# Altium project Car_Follower_Main.PrjPcb
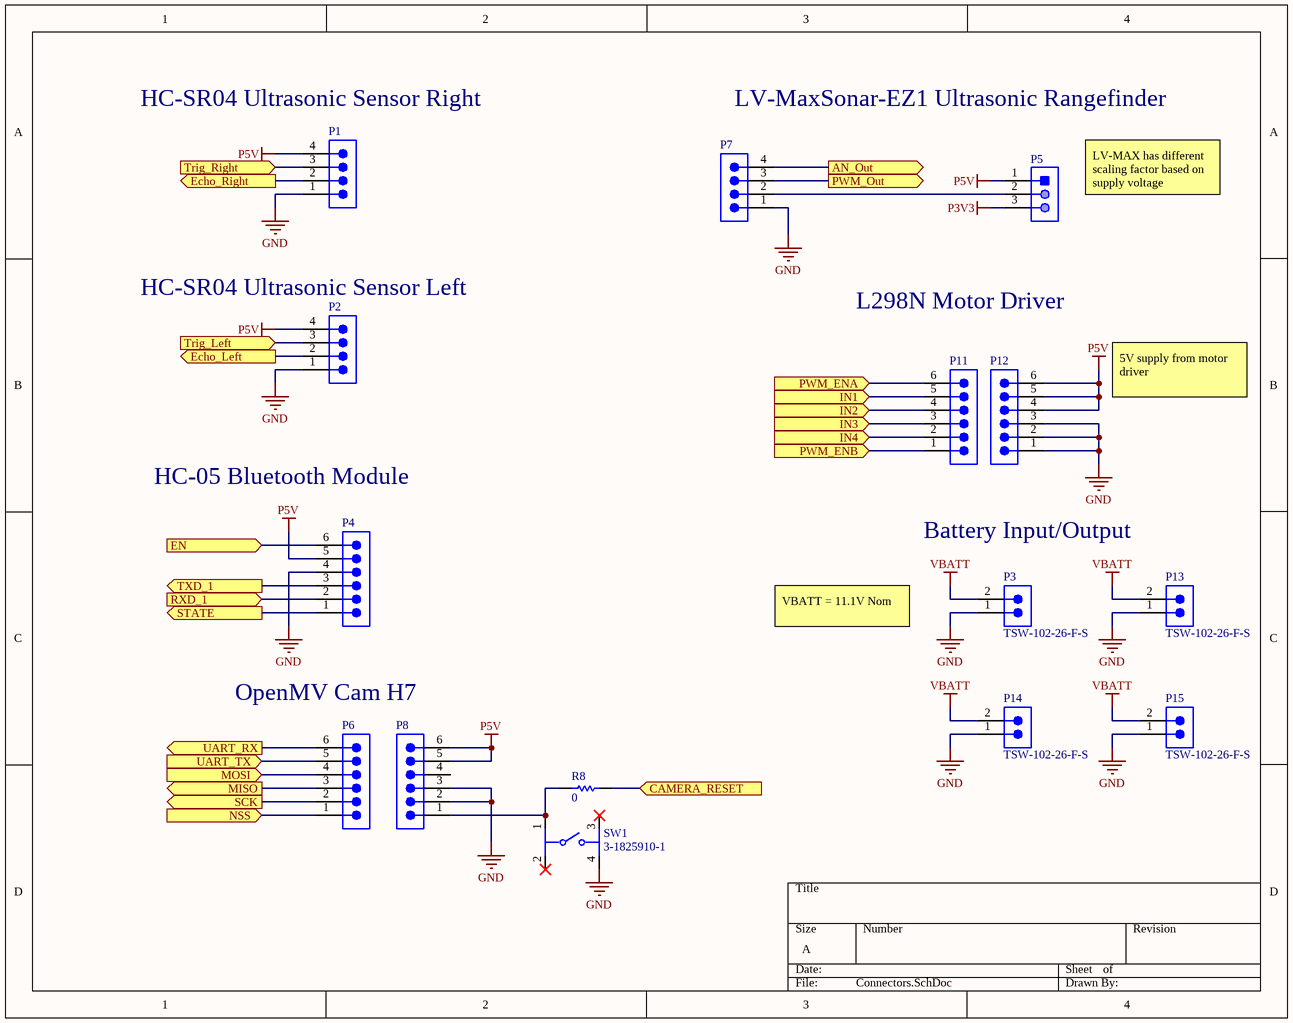
[diagram p0: Connectors.SchDoc]
2 sheets, 35 parts. Net scope: flat (ports and power ports of the same name join across sheets).
Board file: Auto_Follower_Controller.PcbDoc
Sheets:
  Connectors.SchDoc
  Power_Tree.SchDoc

## Sheet Connectors.SchDoc
size A; SheetNumber: 1; SheetTotal: 5

### Parts
P1  TSW-104-08-T-S  [SMTC-TSW-104-08-X-S]  (value not drawn)
P2  TSW-104-08-T-S  [SMTC-TSW-104-08-X-S]  (value not drawn)
P3  TSW-102-26-F-S  [SMTC-TSW-102-26-XX-S]
P4  TSW-106-23-G-S  [SMTC-TSW-106-23-X-S]  (value not drawn)
P5  87224-3  [TECO-87224-3_V]  (value not drawn)
P6  TSW-106-23-G-S  [SMTC-TSW-106-23-X-S]  (value not drawn)
P7  TSW-104-08-T-S  [SMTC-TSW-104-08-X-S]  (value not drawn)
P8  TSW-106-23-G-S  [SMTC-TSW-106-23-X-S]  (value not drawn)
P11  TSW-106-23-G-S  [SMTC-TSW-106-23-X-S]  (value not drawn)
P12  TSW-106-23-G-S  [SMTC-TSW-106-23-X-S]  (value not drawn)
P13  TSW-102-26-F-S  [SMTC-TSW-102-26-XX-S]
P14  TSW-102-26-F-S  [SMTC-TSW-102-26-XX-S]
P15  TSW-102-26-F-S  [SMTC-TSW-102-26-XX-S]
R8  value 0  [RESC3216X60X45ML15T20]  (hidden comment: Resistor 0R +/- 5% 1206 250 mW)
SW1  3-1825910-1  [FP-3-1825910-1-MFG]

### Ports
AN_Out (out), CAMERA_RESET (in), Echo_Left (out), Echo_Right (out), EN (in), IN1 (in), IN2 (in), IN3 (in), IN4 (in), MISO (out), MOSI (in), NSS (in), PWM_ENA (in), PWM_ENB (in), PWM_Out (out), RXD_1 (in), SCK (out), STATE (out), Trig_Left (in), Trig_Right (in), TXD_1 (out), UART_RX (out), UART_TX (in)

### Nets
GND: P1.1 P2.1 P3.1 P4.4 P7.1 P8.2 P8.3 P12.1 P12.2 P12.3 P13.1 P14.1 P15.1 SW1.4
P3V3: P5.3
P5V: P1.4 P2.4 P4.5 P5.1 P8.5 P8.6 P12.4 P12.5 P12.6
VBATT: P3.2 P13.2 P14.2 P15.2
NetP1_2: P1.2 ; port Echo_Right
NetP1_3: P1.3 ; port Trig_Right
NetP2_2: P2.2 ; port Echo_Left
NetP2_3: P2.3 ; port Trig_Left
NetP4_1: P4.1 ; port STATE
NetP4_2: P4.2 ; port RXD_1
NetP4_3: P4.3 ; port TXD_1
NetP4_6: P4.6 ; port EN
NetP5_2: P5.2 P7.2
NetP6_1: P6.1 ; port NSS
NetP6_2: P6.2 ; port SCK
NetP6_3: P6.3 ; port MISO
NetP6_4: P6.4 ; port MOSI
NetP6_5: P6.5 ; port UART_TX
NetP6_6: P6.6 ; port UART_RX
NetP7_3: P7.3 ; port PWM_Out
NetP7_4: P7.4 ; port AN_Out
NetP8_1: P8.1 R8.1 SW1.1
NetP11_1: P11.1 ; port PWM_ENB
NetP11_2: P11.2 ; port IN4
NetP11_3: P11.3 ; port IN3
NetP11_4: P11.4 ; port IN2
NetP11_5: P11.5 ; port IN1
NetP11_6: P11.6 ; port PWM_ENA
NetR8_2: R8.2 ; port CAMERA_RESET

Not connected (* = marked no-connect by the designer): P8 4; SW1 2* 3*

### Notes on the sheet
- (near P1) HC-SR04 Ultrasonic Sensor Right
- LV-MaxSonar-EZ1 Ultrasonic Rangefinder
- LV-MAX has different scaling factor based on supply voltage
- (near P2) HC-SR04 Ultrasonic Sensor Left
- L298N Motor Driver
- 5V supply from motor driver
- HC-05 Bluetooth Module
- Battery Input/Output
- VBATT = 11.1V Nom
- OpenMV Cam H7

### Library data of the parts
P1 P2 P7 = CMP-1024-00356-1: 0.025" SQ Post Header, Through-hole, Vertical, -55 to 105 degC, 2.54 mm Pitch, 4-Pin, Male, RoHS; Manufacturer: Samtec; Pitch: 2.54 mm; PackageDescription: .025[0.64] SQ. Post Terminal Strip Assembly; ComponentLink2URL: http://www.samtec.com/documents/webfiles/pdf/TSW_TH.PDF; ComponentLink3URL: http://www.samtec.com/documents/webfiles/cpdf/TSW-XXX-XX-XXX-X-XX-XXX-MKT.pdf; PackageVersion: DM, 8/1988; ComponentLink3Description: Package Specification; DatasheetVersion: F-214; Orientation: Vertical; RoHS: True; Mounting Technology: Through-hole; ComponentLink1URL: http://www.samtec.com; PartNumber: TSW-104-08-T-S; ComponentLink1Description: Manufacturer URL; Temperature Range: -55 to 105 degC; ComponentLink2Description: Datasheet; PackageReference: TSW-104-08-X-S
P3 P13-P15 = CMP-002-00072-1: Headers & Wire Housings Classic PCB Header Strips, 0.100 pitch; Number of Positions: 2; Max Voltage Rating (AC): 550V; Gender: Male; Pitch: 2.54mm; Contact Post Length: 3.2mm; Voltage Rating: 500V; Max Current Rating: 7.6A; Contact Material: Bronze; Contact Gender: Male; Contact Type: -; REACH SVHC: No SVHC; Min Operating Temperature: -55°C; Housing Material: Polyester; Packaging: Bulk; Termination: Through Hole; Max Operating Temperature: 125°C; Orientation: Vertical; Flammability Rating: UL94 V-0; Package Quantity: 1; Depth: 2.54mm; Contact Plating: Gold; Number of Rows: 1; Radiation Hardening: No; Number of Contacts: 2; Length: 5.08mm; RoHS Compliant: Yes; Housing Color: Black; Weight: 0.001257oz; Contact Mating Length: 5.84mm; Series: TSW
P4 P6 P8 P11 P12 = CMP-1024-00396-1: 0.025" SQ Post Header, Through-hole, Vertical, -55 to 125 degC, 2.54 mm Pitch, 6-Pin, Male, RoHS; Manufacturer: Samtec; Pitch: 2.54 mm; Orientation: Vertical; Mounting Technology: Through-hole; RoHS: True; PackageVersion: DM, 8/1988; ComponentLink3Description: Package Specification; PackageDescription: .025[0.64] SQ. Post Terminal Strip Assembly; ComponentLink2URL: http://www.samtec.com/documents/webfiles/pdf/TSW_TH.PDF; PartNumber: TSW-106-23-G-S; Temperature Range: -55 to 125 degC; PackageReference: TSW-106-23-X-S; ComponentLink1Description: Manufacturer URL; ComponentLink2Description: Datasheet; ComponentLink3URL: http://www.samtec.com/documents/webfiles/cpdf/TSW-XXX-XX-XXX-X-XX-XXX-MKT.pdf; DatasheetVersion: F-214; ComponentLink1URL: http://www.samtec.com
P5 = CMP-2000-05697-1: Male Header, Pitch 2.54 mm, 1 x 3 Position, Height 10.744 mm, Tail Length 3.175 mm, -65 to 105 degC, RoHS, Bulk; Manufacturer: TE Connectivity; Catalog Drawings: SingleSquareStraightPost / SingleSquareStraightPostSide; Connector Type: Header,Unshrouded; Pitch: 0.100"(2.54mm); Mating Products: 147738-2-ND / -CONNRCPT3POSVERTSMDGOLD / 147723-2-ND / -CONNRCPT3POSVERT.100GOLD / 146763-5-ND / -CONNRCPT3POSSGLVERT.100T/H / A32904-ND / -CONNRECEPT3POS.100VERTGOLD / A26922-ND / -CONNHOUSING3POS.100LOCKING / A26415-ND / -CONNRECEPT3POS.100VERTAU / A26964-ND / -CONNHOUSING3POS.100SINGLE / A3012-ND / -CONNHOUSING3POS.100SINGLE; Number of Positions Loaded: All; Featured Product: AMPMODUConnectors; Dynamic Catalog: AMPMODUModIISeries; 3D Model: 87224-3.pdf; Other Names: 87224-3-ND / A26545; Number of Positions: 3; RoHS Information: 87224-3StatementofCompliance; Termination: Solder; Datasheet URL: http://www.te.com/commerce/DocumentDelivery/DDEController?Action=showdoc&DocId=Customer+Drawing%7F87224%7FL3%7Fpdf%7FEnglish%7FENG_CD_87224_L3.pdf%7F87224-3; Category: Connectors,Interconnects; Contact Mating Length: 0.318"(8.08mm); Standard Package: 520; Mounting Type: ThroughHole; Family: RectangularConnectors-Headers,MalePins; Number of Rows: 1; Series: AMPMODUModII; Contact Finish Thickness: 15µin(0.38µm); Datasheet Version: Rev. L3, 08/2015; Package Reference: 87224-3; Mounting Technology: ThroughHole; Manufacturer URL: http://www.te.com/; Contact Type: MalePin; Packaging: Bulk; Color: Black; Package Description: Male Header, Pitch 2.54 mm, 1 x 3 Position, Height 10.744 mm, Tail Length 3.175 mm; Contact Finish: Gold
R8 = CMP-009-00002-4: Chip Resistor, 0 Ohm, +/- 5%, 0.25 W, -55 to 155 degC, 1206 (3216 Metric); Voltage Rating: 200V; Power: 250mW; Case/Package: 1206; Mounting Technology: SM; RoHS Compliant: True; Min Operating Temperature: -55°C; Max Operating Temperature: 155°C; Tolerance: 5%; Pins: 2
SW1 = CMP-03407-000001-1: SWITCH TACTILE SPST-NO 0.05A 24V; Manufacturer: TE Connectivity; Operating Force: 160gf; Contact Current Rating: 50mA; Description: Switch Tactile OFF (ON) SPST Round Button PC Pins 0.05A 24VDC 100000Cycles 1.57N Thru-Hole; Contact Resistance: 100mΩ; Electromechanical Life: 100000Cycles; Device Class L1: Electromechanical; ComponentLink2URL: https://www.te.com/commerce/DocumentDelivery/DDEController?Action=srchrtrv&DocNm=1825910&DocType=Customer+Drawing&DocLang=English; Category: Switch; Device Class L2: Switches; Temperature: -35°C to +85°C; RoHS: TRUE; Mount: Through Hole; Manufacturer Part Number: 3-1825910-1; Automotive: No; Lead Free: Yes; Device Class L3: Tactile Switches; ComponentLink2Description: Datasheet; Temperature Range High: +85°C; Height: 17.3mm; Package: 0; Temperature Range Low: -35°C; Throw Configuration: SPST-NO; Digikey Description: SWITCH TACTILE SPST-NO 0.05A 24V; Octopart: https://octopart.com/3-1825910-1-te+connectivity-46506874

## Sheet Power_Tree.SchDoc
size A; SheetNumber: 3; SheetTotal: 5
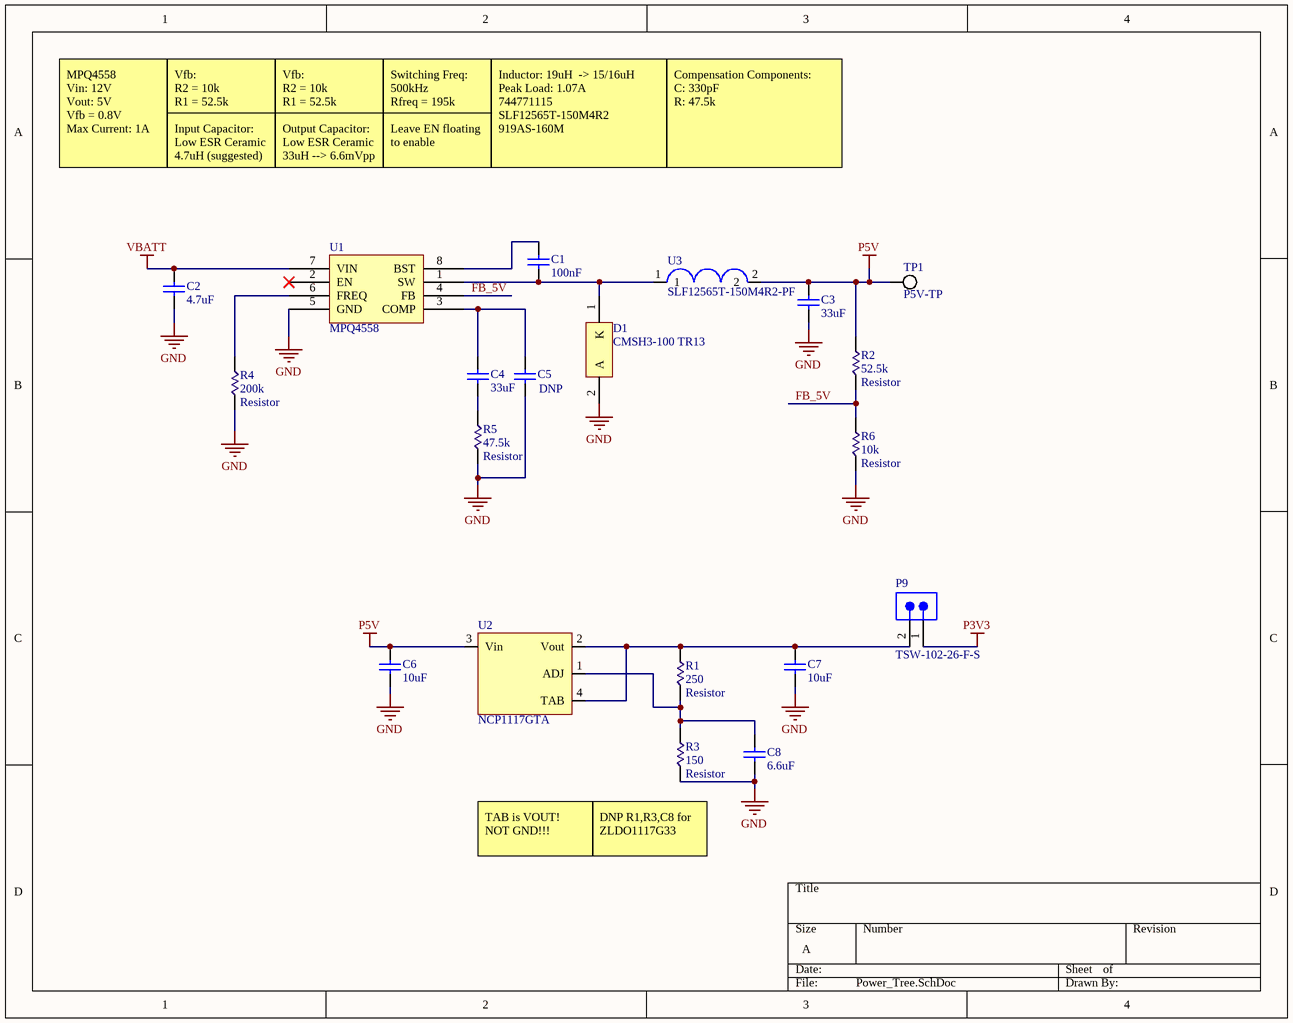
[diagram p1: Power_Tree.SchDoc]

### Parts
C1  value 100nF  [FOOTPRINT-1206-GEN]  (hidden comment: 100nF 1206)
C2  value 4.7uF  [FOOTPRINT-1206-GEN]  (hidden comment: CL31B475KBHVPNE)
C3  value 33uF  [FOOTPRINT-1206-GEN]
C4  value 33uF  [FOOTPRINT-1206-GEN]
C5  DNP  [FOOTPRINT-1206-GEN]
C6  value 10uF  [FOOTPRINT-1206-GEN]
C7  value 10uF  [FOOTPRINT-1206-GEN]
C8  value 6.6uF  [FOOTPRINT-1206-GEN]
D1  CMSH3-100 TR13  [ONSC-SMB-2-403A-03_V]
P9  TSW-102-26-F-S  [SMTC-TSW-102-26-XX-S]
R1  value 250  Type: Resistor  [FOOTPRINT-1206-GEN]  (hidden comment: Resistor 250 +/-1% 1206 1/4W)
R2  value 52.5k  Type: Resistor  [FOOTPRINT-1206-GEN]  (hidden comment: Resistor 52.5k +/-1% 1206 1/4W)
R3  value 150  Type: Resistor  [FOOTPRINT-1206-GEN]  (hidden comment: Resistor 150 +/-1% 1206 1/4W)
R4  value 200k  Type: Resistor  [FOOTPRINT-1206-GEN]  (hidden comment: Resistor 200k +/-1% 1206 1/4W)
R5  value 47.5k  Type: Resistor  [FOOTPRINT-1206-GEN]  (hidden comment: Resistor 47.5k +/-1% 1206 1/4W)
R6  value 10k  Type: Resistor  [FOOTPRINT-1206-GEN]  (hidden comment: Resistor 10k +/-1% 1206 1/4W)
TP1  P5V-TP  [FOOTPRINT-GENERIC-TP-VIA-1MM]  (no BOM)
U1  MPQ4558  [SOIC127P601X173-9N]
U2  NCP1117GTA  [SOT230P700X180-4N]
U3  SLF12565T-150M4R2-PF  [0.492" x 0.492"]

### Nets
GND: C2.1 C3.1 C5.1 C6.1 C7.1 C8.1 D1.2(A) R3.1 R4.1 R5.1 R6.1 U1.5(GND)
P3V3: P9.1
P5V: C3.2 C6.2 R2.2 TP1.1(TP) U2.3(Vin) U3.2
VBATT: C2.2 U1.7(VIN)
FB_5V: R2.1 R6.2 U1.4(FB)
NetC1_1: C1.1 D1.1(K) U1.1(SW) U3.1
NetC1_2: C1.2 U1.8(BST)
NetC4_1: C4.1 R5.2
NetC4_2: C4.2 C5.2 U1.3(COMP)
NetC7_2: C7.2 P9.2 R1.2 U2.2(Vout) U2.4(TAB)
NetC8_2: C8.2 R1.1 R3.2 U2.1(ADJ)
NetR4_2: R4.2 U1.6(FREQ)

Not connected (* = marked no-connect by the designer): U1 2(EN)*

### Notes on the sheet
- MPQ4558
  Vin: 12V
  Vout: 5V
  Vfb = 0.8V
  Max Current: 1A
- Vfb:
  R2 = 10k
  R1 = 52.5k
- Input Capacitor:
  Low ESR Ceramic
  4.7uH (suggested)
- Output Capacitor:
  Low ESR Ceramic
  33uH --> 6.6mVpp
- Switching Freq: 500kHz
  Rfreq = 195k
- Leave EN floating to enable
- Inductor: 19uH  -> 15/16uH
  Peak Load: 1.07A
  744771115
  SLF12565T-150M4R2
  919AS-160M
- Compensation Components:
  C: 330pF
  R: 47.5k
- TAB is VOUT!
  NOT GND!!!
- (near R3) DNP R1,R3,C8 for
  ZLDO1117G33

### Library data of the parts
C1 = CMP-001-00085-2: CAP CER 100nF 50V X7R 1206 ±10% 50V Ceramic Capacitor X7R 1206 (3216 Metric); Part Number: 1276-6781-1-ND; Published: 8-Jun-2000; LatestRevisionNote: Re-released for DXP Platform.; PackageReference: RAD-0.3; Publisher: Altium Limited; PackageDescription: Radial Cap, Thru-Hole; 2 Leads; 0.3 in Pin Spacing; Design Item ID: Capacitor-Generic-1206; Source: Generic.SchLib; Type: Capacitor
C2 = CMP-001-00085-2: CAP CER 4.7UF 50V X7R 1206 ±10% 50V Ceramic Capacitor X7R 1206 (3216 Metric); Part Number: 1276-6781-1-ND; Published: 8-Jun-2000; LatestRevisionNote: Re-released for DXP Platform.; PackageReference: RAD-0.3; Publisher: Altium Limited; PackageDescription: Radial Cap, Thru-Hole; 2 Leads; 0.3 in Pin Spacing; Design Item ID: Capacitor-Generic-1206; Source: Generic.SchLib; Type: Capacitor
C3 C4 = CMP-001-00085-2: CAP CER 33UF 50V X7R 1206 ±10% 50V Ceramic Capacitor X7R 1206 (3216 Metric); Part Number: 1276-6781-1-ND; Published: 8-Jun-2000; LatestRevisionNote: Re-released for DXP Platform.; PackageReference: RAD-0.3; Publisher: Altium Limited; PackageDescription: Radial Cap, Thru-Hole; 2 Leads; 0.3 in Pin Spacing; Design Item ID: Capacitor-Generic-1206; Source: Generic.SchLib; Type: Capacitor
C5 = CMP-001-00085-2: 1206; Part Number: 1276-6781-1-ND; Type: Capacitor; Published: 8-Jun-2000; LatestRevisionNote: Re-released for DXP Platform.; PackageReference: RAD-0.3; Publisher: Altium Limited; PackageDescription: Radial Cap, Thru-Hole; 2 Leads; 0.3 in Pin Spacing; Design Item ID: Capacitor-Generic-1206; Source: Generic.SchLib
C6 C7 = CMP-001-00085-2: CAP CER 10UF 50V X7R 1206 ±10% 50V Ceramic Capacitor X7R 1206 (3216 Metric); Part Number: 1276-6781-1-ND; Published: 8-Jun-2000; LatestRevisionNote: Re-released for DXP Platform.; PackageReference: RAD-0.3; Publisher: Altium Limited; PackageDescription: Radial Cap, Thru-Hole; 2 Leads; 0.3 in Pin Spacing; Design Item ID: Capacitor-Generic-1206; Source: Generic.SchLib; Type: Capacitor
C8 = CMP-001-00085-2: CAP CER 6.6UF 50V X7R 1206 ±10% 50V Ceramic Capacitor X7R 1206 (3216 Metric); Part Number: 1276-6781-1-ND; Published: 8-Jun-2000; LatestRevisionNote: Re-released for DXP Platform.; PackageReference: RAD-0.3; Publisher: Altium Limited; PackageDescription: Radial Cap, Thru-Hole; 2 Leads; 0.3 in Pin Spacing; Design Item ID: Capacitor-Generic-1206; Source: Generic.SchLib; Type: Capacitor
D1 = CMP-1055-00373-1: CMSH3-100 TR13 Schottky Power Rectifier, 2-Pin SMB, Pb-Free, Tape and Reel; PartNumber: SS22T3G; Manufacturer: On Semiconductor; IFSM Max (A): 75; Configuration: Single; DatasheetVersion: Rev. 4; PackageVersion: Rev. J, 07/2012; ComponentLink3Description: Package Specification; ComponentLink2Description: Datasheet; PackageDescription: 2-Pin Small Molded Package, J-Bend Lead, Body 4.33 x 3.625 mm; Mounting Technology: Surface Mount; ComponentLink3URL: http://www.onsemi.com/pub_link/Collateral/403A-03.PDF; Packing: Tape and Reel; ComponentLink1URL: http://www.onsemi.com/; ComponentLink2URL: http://www.onsemi.cn/pub_link/Collateral/SS24-D.PDF; PackageReference: SMB-2-403A-03; RoHS: TRUE; ComponentLink1Description: Manufacturer URL
P9 = CMP-002-00072-1: as P3 on sheet Connectors; Contact Material: Bronze; Contact Gender: Male; Contact Type: -; REACH SVHC: No SVHC; Min Operating Temperature: -55°C; Housing Material: Polyester; Packaging: Bulk; Termination: Through Hole; Max Operating Temperature: 125°C; Orientation: Vertical; Flammability Rating: UL94 V-0; Package Quantity: 1; Depth: 2.54mm; Contact Plating: Gold; Number of Rows: 1; Radiation Hardening: No; Number of Contacts: 2; Length: 5.08mm; RoHS Compliant: Yes; Housing Color: Black; Weight: 0.001257oz; Contact Mating Length: 5.84mm; Series: TSW
R1 = CMP-009-00204-1: 250 ±1% 0.25W, 1/4W Chip Resistor 1206 (3216 Metric) Automotive AEC-Q200 Thick Film; Design Item ID: Resistor-Generic-1206-3216; Source: Generic.SchLib
R2 = CMP-009-00204-1: 52.5k ±1% 0.25W, 1/4W Chip Resistor 1206 (3216 Metric) Automotive AEC-Q200 Thick Film; Design Item ID: Resistor-Generic-1206-3216; Source: Generic.SchLib
R3 = CMP-009-00204-1: 150 ±1% 0.25W, 1/4W Chip Resistor 1206 (3216 Metric) Automotive AEC-Q200 Thick Film; Design Item ID: Resistor-Generic-1206-3216; Source: Generic.SchLib
R4 = CMP-009-00204-1: 200k ±1% 0.25W, 1/4W Chip Resistor 1206 (3216 Metric) Automotive AEC-Q200 Thick Film; Design Item ID: Resistor-Generic-1206-3216; Source: Generic.SchLib
R5 = CMP-009-00204-1: 47.5k ±1% 0.25W, 1/4W Chip Resistor 1206 (3216 Metric) Automotive AEC-Q200 Thick Film; Design Item ID: Resistor-Generic-1206-3216; Source: Generic.SchLib
R6 = CMP-009-00204-1: 10k ±1% 0.25W, 1/4W Chip Resistor 1206 (3216 Metric) Automotive AEC-Q200 Thick Film; Design Item ID: Resistor-Generic-1206-3216; Source: Generic.SchLib
TP1 = CMP-025-000000-1: Source: Generic.SchLib; Design Item ID: Misc-Generic-TP
U1 = CMP-047-000002-2: Source: Schlib1.SchLib; Design Item ID: MPQ4558

## Nets that join several sheets
GND: Connectors (14 pins), Power_Tree (12 pins)
P3V3: Connectors (P5.3), Power_Tree (P9.1)
P5V: Connectors (9 pins), Power_Tree (6 pins)
VBATT: Connectors (P3.2 P13.2 P14.2 P15.2), Power_Tree (C2.2 U1.7)